# EAGLE design ESP32-S3 4.2“ EINK V1.3 (EAGLE 6.1)
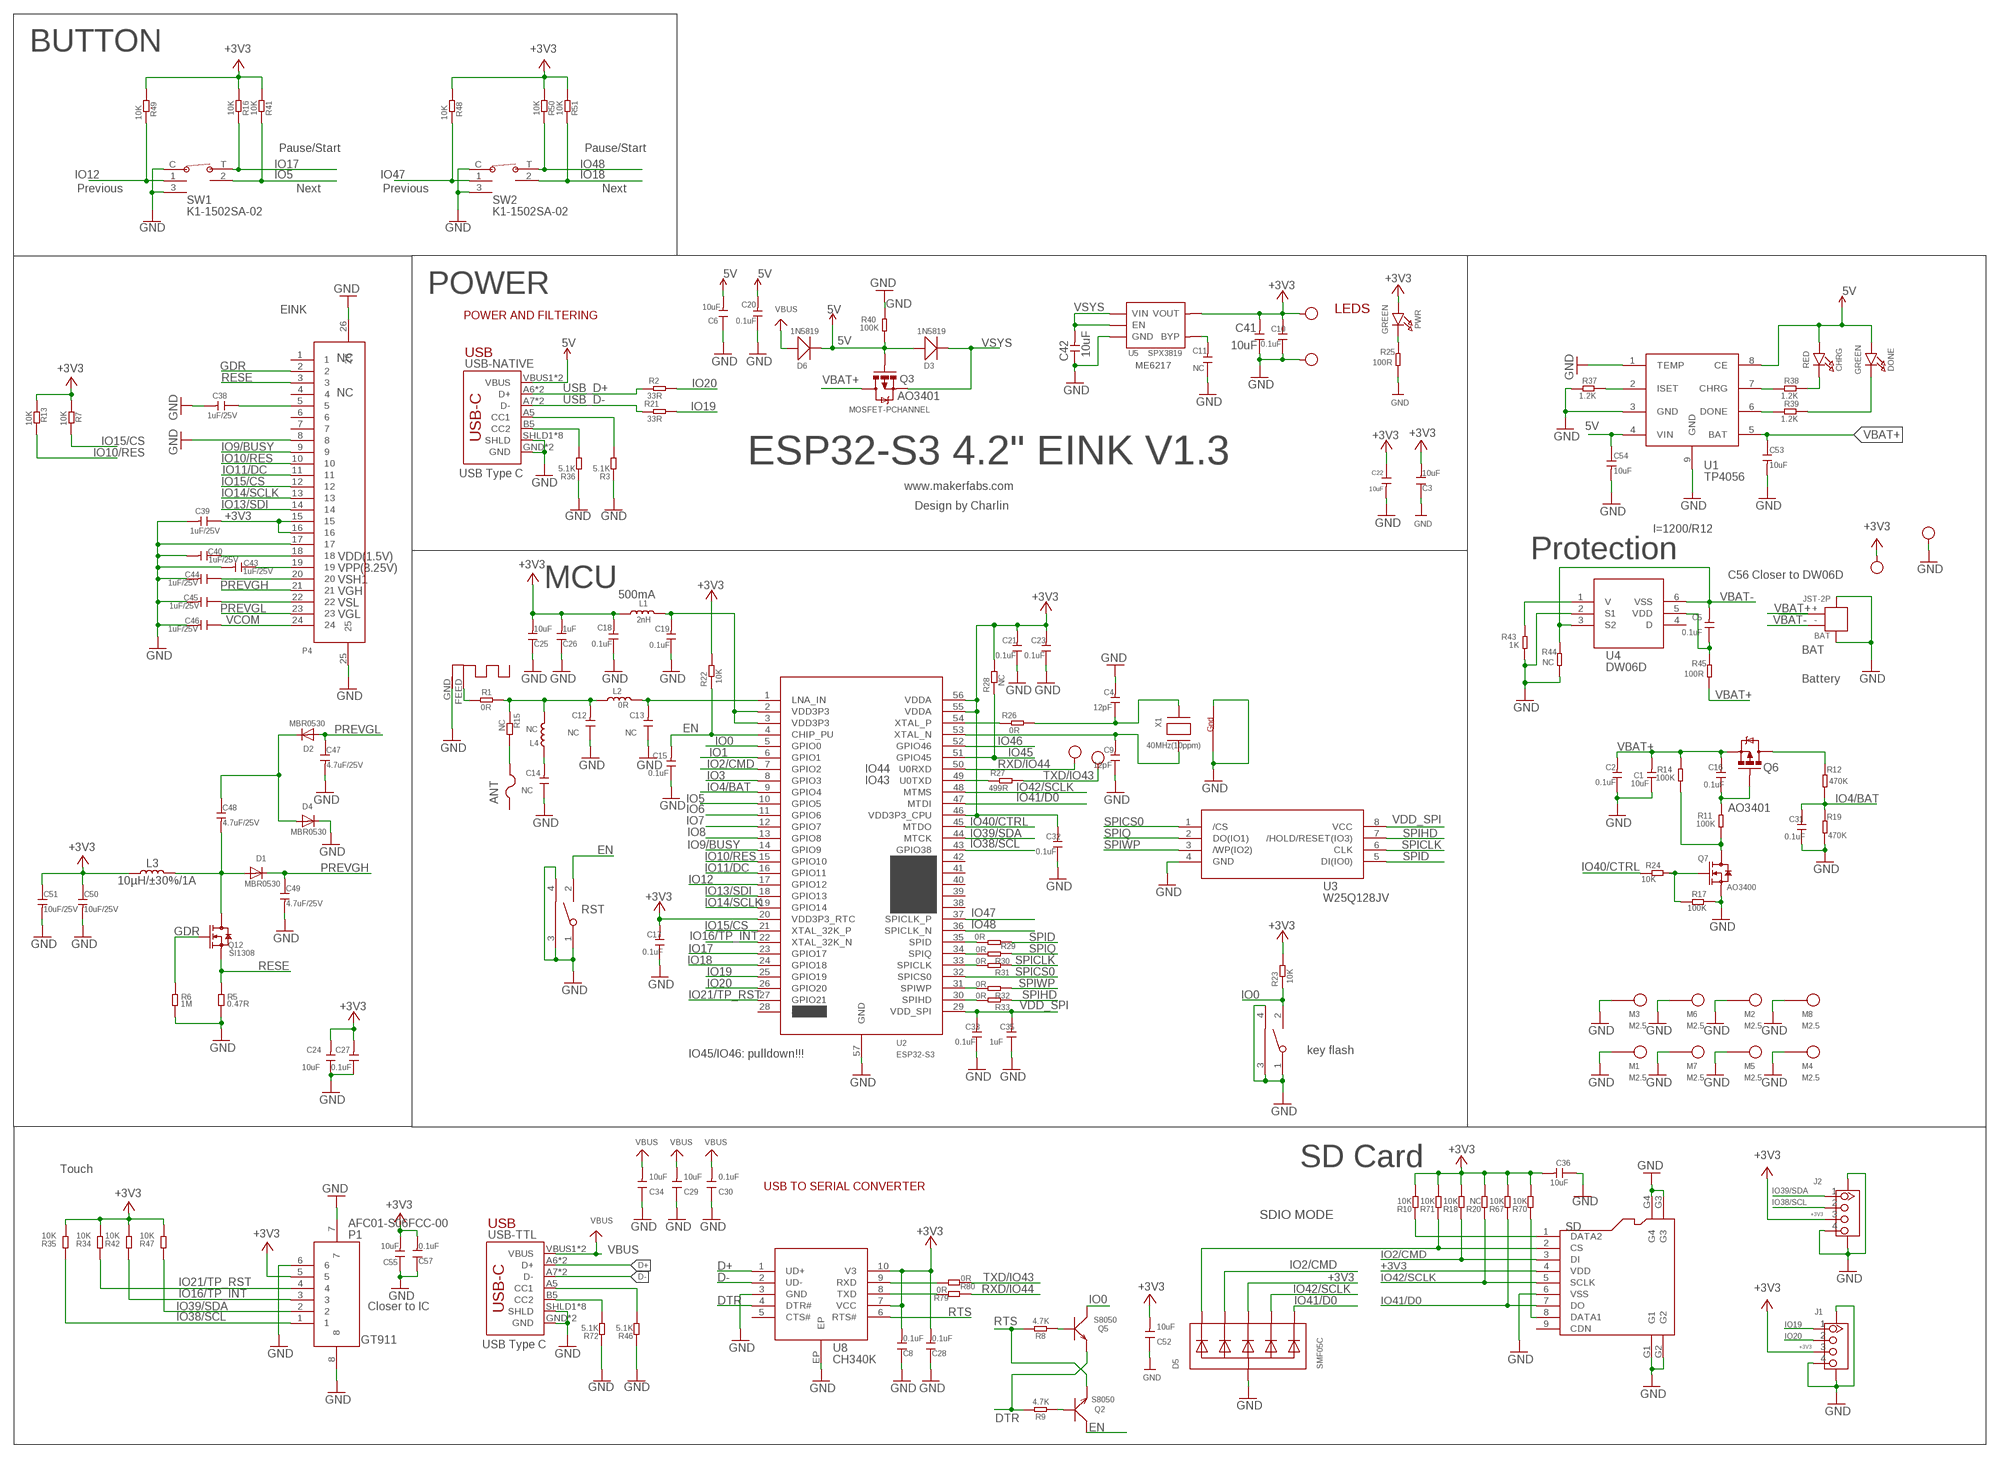
[diagram p0: schematic, sheet 1]

## Parts
3V3  TEST-POINT'4545'  [TP-D45MIL]
ANT  PTCFUSE-1206  [R1206]
ANT1  ANTENNA  [RN-ANT]
BAT  JST-2P  JST-2P-SMD'2.0'  [HW2-SMD-2.0-90D]
C1  10uF  C-0603  [0603]
C2  0.1uF  C-0603  [0603]
C3  10uF  DISCRETE_C-0603  [DISCRETE_C0603]
C4  12pF  C-0603  [0603]
C5  0.1uF  C-0603  [0603]
C6  10uF  DISCRETE_C-0603  [DISCRETE_C0603]
C8  0.1uF  DISCRETE_C-0603  [DISCRETE_C0603]
C9  12pF  C-0603  [0603]
C10  0.1uF  C-0603  [0603]
C11  NC  C-0603  [0603]
C12  NC  C-0603  [0603]
C13  NC  C-0603  [0603]
C14  NC  C-0603  [0603]
C15  0.1uF  C-0603  [0603]
C16  0.1uF  C-0603  [0603]
C17  0.1uF  C-0603  [0603]
C18  0.1uF  C-0603  [0603]
C19  0.1uF  C-0603  [0603]
C20  0.1uF  C-0603  [0603]
C21  0.1uF  C-0603  [0603]
C22  10uF  C-0603  [0603]
C23  0.1uF  C-0603  [0603]
C24  10uF  C-0603  [0603]
C25  10uF  DISCRETE_C-0603  [DISCRETE_C0603]
C26  1uF  DISCRETE_C-0603  [DISCRETE_C0603]
C27  0.1uF  C-0603  [0603]
C28  0.1uF  DISCRETE_C-0603  [DISCRETE_C0603]
C29  10uF  DISCRETE_C-0603  [DISCRETE_C0603]
C30  0.1uF  DISCRETE_C-0603  [DISCRETE_C0603]
C31  0.1uF  C-0603  [0603]
C32  0.1uF  C-0603  [0603]
C33  0.1uF  C-0603  [0603]
C34  10uF  DISCRETE_C-0603  [DISCRETE_C0603]
C35  1uF  C-0603  [0603]
C36  10uF  DISCRETE_C-0603  [DISCRETE_C0603]
C38  1uF/25V  C-0603  [0603]
C39  1uF/25V  C-0603  [0603]
C40  1uF/25V  C-0603  [0603]
C41  10uF  C-0603  [0603]
C42  10uF  C-0603  [0603]
C43  1uF/25V  C-0603  [0603]
C44  1uF/25V  C-0603  [0603]
C45  1uF/25V  C-0603  [0603]
C46  1uF/25V  C-0603  [0603]
C47  4.7uF/25V  C-0603  [0603]
C48  4.7uF/25V  C-0603  [0603]
C49  4.7uF/25V  C-0603  [0603]
C50  10uF/25V  C-0603  [0603]
C51  10uF/25V  C-0603  [0603]
C52  10uF  DISCRETE_C-0603  [DISCRETE_C0603]
C53  10uF  C-0603  [0603]
C54  10uF  C-0603  [0603]
C55  10uF  DISCRETE_C-0603  [DISCRETE_C0603]
C57  0.1uF  DISCRETE_C-0603  [DISCRETE_C0603]
CHRG  RED  LED0805_NOOUTLINE  [CHIPLED_0805_NOOUTLINE]
D1  MBR0530  DIODESOD-323F  [SOD-323F]
D2  MBR0530  DIODESOD-323F  [SOD-323F]
D3  1N5819  D'0805'  [SOD323]
D4  MBR0530  DIODESOD-323F  [SOD-323F]
D5  SMF05C  TVSARRAY_5LANE  [SOT363]
D6  1N5819  D'0805'  [SOD323]
DONE  GREEN  LED0805_NOOUTLINE  [CHIPLED_0805_NOOUTLINE]
FLASH  TS24CA  [2*4*3.5MM]
G  TEST-POINT'4545'  [TP-D45MIL]
GND  TEST-POINT'4545'  [TP-D45MIL]
J1  GROVE-CONNECTOR-SMD'90D'  [HW4-SMD-2.0-90D]
J2  GROVE-CONNECTOR-SMD'90D'  [HW4-SMD-2.0-90D]
L1  2nH  DISCRETE_L0603  [DISCRETE_L0603]
L2  0R  INDUCTOR-0603-33NH  [0603]
L3  10µH/±30%/1A  INDUCTOR-CR54-47UH  [CR54]
L4  NC  INDUCTOR-0603-33NH  [0603]
M1  M2.5  [M2.5]
M2  M2.5  [M2.5]
M3  M2.5  [M2.5]
M4  M2.5  [M2.5]
M5  M2.5  [M2.5]
M6  M2.5  [M2.5]
M7  M2.5  [M2.5]
M8  M2.5  [M2.5]
P1  AFC01-S06FCC-00  [SMD8-50P-740L535W]
P4  FPC-24P  [SMD26-50P-1760L450W]
PWR  GREEN  LED0805_NOOUTLINE  [CHIPLED_0805_NOOUTLINE]
Q2  S8050  TRANSISTOR-NPN-SOT23  [SOT23]
Q3  MOSFET-PCHANNEL  [SOT23-3]
Q5  S8050  TRANSISTOR-NPN-SOT23  [SOT23]
Q6  MOSFET-PCHANNEL  [SOT23-3]
Q7  AO3400  DISCRETE_MOSFET-NSOT23  [DISCRETE_SOT23]
Q12  SI1308  MOSFET-N'SOT23'  [SOT23]
R1  0R  R-0603  [R0603]
R2  33R  R-0603  [R0603]
R3  5.1K  DISCRETE_R-0603  [DISCRETE_R0603]
R5  0.47R  R-0603  [R0603]
R6  1M  R-0603  [R0603]
R7  10K  R-0603  [R0603]
R8  4.7K  R-0603  [R0603]
R9  4.7K  R-0603  [R0603]
R10  10K  DISCRETE_R-0603  [DISCRETE_R0603]
R11  100K  R-0603  [R0603]
R12  470K  R-0603  [R0603]
R13  10K  R-0603  [R0603]
R14  100K  R-0603  [R0603]
R15  NC  R-0603  [R0603]
R16  10K  R-0603  [R0603]
R17  100K  R-0603  [R0603]
R18  10K  DISCRETE_R-0603  [DISCRETE_R0603]
R19  470K  R-0603  [R0603]
R20  NC  DISCRETE_R-0603  [DISCRETE_R0603]
R21  33R  R-0603  [R0603]
R22  10K  R-0603  [R0603]
R23  10K  R-0603  [R0603]
R24  10K  R-0603  [R0603]
R25  100R  R-0603  [R0603]
R26  0R  R-0603  [R0603]
R27  499R  R-0603  [R0603]
R28  NC  R-0603  [R0603]
R29  0R  R-0603  [R0603]
R30  0R  R-0603  [R0603]
R31  0R  R-0603  [R0603]
R32  0R  R-0603  [R0603]
R33  0R  R-0603  [R0603]
R34  10K  DISCRETE_R-0603  [DISCRETE_R0603]
R35  10K  DISCRETE_R-0603  [DISCRETE_R0603]
R36  5.1K  DISCRETE_R-0603  [DISCRETE_R0603]
R37  1.2K  R-0603  [R0603]
R38  1.2K  R-0603  [R0603]
R39  1.2K  R-0603  [R0603]
R40  100K  R-0603  [R0603]
R41  10K  R-0603  [R0603]
R42  10K  DISCRETE_R-0603  [DISCRETE_R0603]
R43  1K  R-0603  [R0603]
R44  NC  R-0603  [R0603]
R45  100R  R-0603  [R0603]
R46  5.1K  DISCRETE_R-0603  [DISCRETE_R0603]
R47  10K  DISCRETE_R-0603  [DISCRETE_R0603]
R48  10K  R-0603  [R0603]
R49  10K  R-0603  [R0603]
R50  10K  R-0603  [R0603]
R51  10K  R-0603  [R0603]
R67  10K  DISCRETE_R-0603  [DISCRETE_R0603]
R70  10K  DISCRETE_R-0603  [DISCRETE_R0603]
R71  10K  DISCRETE_R-0603  [DISCRETE_R0603]
R72  5.1K  DISCRETE_R-0603  [DISCRETE_R0603]
R79  0R  R-0603  [R0603]
R80  0R  R-0603  [R0603]
RST  TS24CA  [2*4*3.5MM]
RX  TEST-POINT'4545'  [TP-D45MIL]
SD  HOLDER-MICROSD-9P  [9P-SMD-W/-RING]
SW1  K1-1502SA-02  [SMD5-60P-1180L1170W]
SW2  K1-1502SA-02  [SMD5-60P-1180L1170W]
TX  TEST-POINT'4545'  [TP-D45MIL]
U1  TP4056  [SOP8-1.27P]
U2  ESP32-S3  [QFN56-7*7MM]
U3  W25Q128JV  [SOIC-8-208MIL]
U4  DW06D  [SOT-23-6]
U5  SPX3819  [SOT23-5]
U8  CH340K  [ESOP-10-EP-150MIL]
USB-NATIVE  USB_C5  [USB-C-16P-5]
USB-TTL  USB_C5  [USB-C-16P-5]
V  TEST-POINT'4545'  [TP-D45MIL]
X1  40MHz(10ppm)  XTAL-4-3225  [NX3225]

## Nets
5V: C6.2 C20.2 C54.1 CHRG.A D3.+ D6.- DONE.A Q3.1(G) R40.1 U1.4(VIN) U1.8(CE) USB-NATIVE.VBUS1(VBUS) USB-NATIVE.VBUS2(VBUS)
+3V3: 3V3.T C3.2 C8.2 C10.2 C17.2 C18.2 C21.2 C22.1 C23.2 C24.2 C25.2 C26.2 C27.2 C28.2 C32.2 C36.2 C39.1 C41.2 C50.1 C51.1 C52.2 C55.2 C57.2 D5.4(C3) J1.3 J2.3 L1.1 L3.P$1 P1.5 P4.15 P4.16 PWR.A R7.1 R10.2 R13.1 R16.1 R18.2 R20.2 R22.2 R23.2 R28.2 R34.2 R35.2 R41.1 R42.2 R47.2 R48.1 R49.1 R50.1 R51.1 R67.2 R70.2 R71.2 SD.4(VDD) U2.20(VDD3P3_RTC) U2.46(VDD3P3_CPU) U2.55(VDDA) U2.56(VDDA) U5.5(VOUT) U8.7(VCC) U8.10(V3) V.T
D+: U8.1(UD+) USB-TTL.A6(D+) USB-TTL.B6(D+)
D-: U8.2(UD-) USB-TTL.A7(D-) USB-TTL.B7(D-)
DONE: R39.2 U1.6(DONE)
DTR: Q5.2(E) R9.2 U8.4(DTR#)
EN: C15.2 Q2.3(C) R22.1 RST.2 U2.4(CHIP_PU)
GDR: P4.2 Q12.1(G) R6.1
GND: ANT1.GND BAT.3 BAT.4 C1.1 C2.1 C3.1 C4.2 C6.1 C8.1 C9.1 C10.1 C11.1 C12.1 C13.1 C14.1 C15.1 C17.1 C18.1 C19.1 C20.1 C21.1 C22.2 C23.1 C24.1 C25.1 C26.1 C27.1 C28.1 C29.1 C30.1 C31.1 C32.1 C33.1 C34.1 C35.1 C36.1 C38.2 C39.2 C40.2 C41.1 C42.1 C43.2 C44.2 C45.2 C46.2 C47.2 C49.2 C50.2 C51.2 C52.1 C53.2 C54.2 C55.1 C57.1 D4.C D5.2(A) FLASH.1 FLASH.3 FLASH.4 G.T GND.T J1.4 J1.SS1 J1.SS2 J2.4 J2.SS1 J2.SS2 M1.1 M2.1 M3.1 M4.1 M5.1 M6.1 M7.1 M8.1 P1.6 P1.7 P1.8 P4.8 P4.17 P4.25 P4.26 Q7.2(S) R3.1 R5.2 R6.2 R17.1 R19.1 R25.1 R36.1 R37.2 R40.2 R43.1 R44.1 R46.1 R72.1 RST.1 RST.3 RST.4 SD.6(VSS) SD.G1 SD.G2 SD.G3 SD.G4 SW1.3 SW1.C SW2.3 SW2.C U1.1(TEMP) U1.3(GND) U1.9(GND) U2.57(GND) U3.4(GND) U4.2(S1) U5.2(GND) U8.3(GND) U8.EP USB-NATIVE.GND USB-NATIVE.GND2(GND) USB-NATIVE.SHLD1(SHLD) USB-NATIVE.SHLD2(SHLD) USB-NATIVE.SHLD3(SHLD) USB-NATIVE.SHLD4(SHLD) USB-NATIVE.SHLD5(SHLD) USB-NATIVE.SHLD6(SHLD) USB-NATIVE.SHLD7(SHLD) USB-NATIVE.SHLD8(SHLD) USB-TTL.GND USB-TTL.GND2(GND) USB-TTL.SHLD1(SHLD) USB-TTL.SHLD2(SHLD) USB-TTL.SHLD3(SHLD) USB-TTL.SHLD4(SHLD) USB-TTL.SHLD5(SHLD) USB-TTL.SHLD6(SHLD) USB-TTL.SHLD7(SHLD) USB-TTL.SHLD8(SHLD) X1.2(G2) X1.4(G1)
IO0: FLASH.2 Q5.3(C) R23.1 U2.5(GPIO0)
IO1: U2.6(GPIO1)
IO2/CMD: D5.3(C2) R18.1 SD.3(DI) U2.7(GPIO2)
IO3: U2.8(GPIO3)
IO4/BAT: C31.2 R12.1 R19.2 U2.9(GPIO4)
IO5: R41.2 SW1.2 U2.10(GPIO5)
IO6: U2.11(GPIO6)
IO7: U2.12(GPIO7)
IO8: U2.13(GPIO8)
IO9/BUSY: P4.9 U2.14(GPIO9)
IO10/RES: P4.10 R13.2 U2.15(GPIO10)
IO11/DC: P4.11 U2.16(GPIO11)
IO12: R49.2 SW1.1 U2.17(GPIO12)
IO13/SDI: P4.14 U2.18(GPIO13)
IO14/SCLK: P4.13 U2.19(GPIO14)
IO15/CS: P4.12 R7.2 U2.21(XTAL_32K_P)
IO16/TP_INT: P1.3 R42.1 U2.22(XTAL_32K_N)
IO17: R16.2 SW1.T U2.23(GPIO17)
IO18: R51.2 SW2.2 U2.24(GPIO18)
IO19: J1.1 R21.2 U2.25(GPIO19)
IO20: J1.2 R2.2 U2.26(GPIO20)
IO21/TP_RST: P1.4 R34.1 U2.27(GPIO21)
IO38/SCL: J2.2 P1.1 R35.1 U2.43(GPIO38)
IO39/SDA: J2.1 P1.2 R47.1 U2.44(MTCK)
IO40/CTRL: R24.2 U2.45(MTDO)
IO41/D0: D5.6(C5) R67.1 SD.7(DO) U2.47(MTDI)
IO42/SCLK: D5.5(C4) R20.1 SD.5(SCLK) U2.48(MTMS)
IO45: R28.1 U2.51(GPIO45)
IO46: U2.52(GPIO46)
IO47: R48.2 SW2.1 U2.37(SPICLK_P)
IO48: R50.2 SW2.T U2.36(SPICLK_N)
ISET: R37.1 U1.2(ISET)
N$1: C38.1 P4.5
N$2: ANT1.FEED R1.1
N$3: C16.1 Q6.1(G) R11.2
N$4: C43.1 P4.19
N$5: C44.1 P4.20
N$6: R3.2 USB-NATIVE.A5(CC1)
N$7: PWR.C R25.2
N$8: Q2.1(B) R9.1
N$9: C45.1 P4.22
N$10: Q6.3(D) R12.2
N$11: C48.1 D2.C D4.A
N$12: Q5.1(B) R8.1
N$13: R79.2 U8.8(TXD)
N$14: R36.2 USB-NATIVE.B5(CC2)
N$15: Q7.3(D) R11.1 R14.1
N$16: R10.1 SD.1(DATA2)
N$17: R46.2 USB-TTL.A5(CC1)
N$18: R72.2 USB-TTL.B5(CC2)
N$19: Q7.1(G) R17.2 R24.1
N$20: R70.1 SD.8(DATA1)
N$22: C40.1 P4.18
N$23: DONE.C R39.1
N$24: R38.2 U1.7(CHRG)
N$25: ANT.2 R15.2
N$26: D5.1(C1) R71.1 SD.2(CS)
N$27: CHRG.C R38.1
N$28: C5.1 R45.2 U4.5(VDD)
N$29: R43.2 U4.1(V)
N$30: C12.2 L2.1 L4.2 R1.2 R15.1
N$31: C13.2 L2.2 U2.1(LNA_IN)
N$32: R29.2 U2.35(SPID)
N$33: C19.2 L1.2 U2.2(VDD3P3) U2.3(VDD3P3)
N$34: C14.2 L4.1
N$35: R30.2 U2.34(SPIQ)
N$36: R80.2 U8.9(RXD)
N$37: R26.1 U2.54(XTAL_P)
N$38: R31.2 U2.33(SPICLK)
N$40: R32.2 U2.31(SPIWP)
N$41: R33.2 U2.30(SPIHD)
N$63: R27.1 U2.49(U0TXD)
N$65: C9.2 U2.53(XTAL_N) X1.3(X2)
N$66: C4.1 R26.2 X1.1(X1)
N$71: C48.2 D1.A L3.P$2 Q12.3(D)
N$76: C11.2 U5.4(BYP)
PREVGH: C49.1 D1.C P4.21
PREVGL: C47.1 D2.A P4.23
RESE: P4.3 Q12.2(S) R5.1
RTS: Q2.2(E) R8.2 U8.6(RTS#)
RXD/IO44: R79.1 RX.T U2.50(U0RXD)
SPICLK: R31.1 U3.6(CLK)
SPICS0: U2.32(SPICS0) U3.1(/CS)
SPID: R29.1 U3.5(DI(IO0))
SPIHD: R33.1 U3.7(/HOLD/RESET(IO3))
SPIQ: R30.1 U3.2(DO(IO1))
SPIWP: R32.1 U3.3(/WP(IO2))
TXD/IO43: R27.2 R80.1 TX.T
USB_D+: R2.1 USB-NATIVE.A6(D+) USB-NATIVE.B6(D+)
USB_D-: R21.1 USB-NATIVE.A7(D-) USB-NATIVE.B7(D-)
VBAT+: BAT.+ C1.2 C2.2 C16.2 C53.1 Q3.3(D) Q6.2(S) R14.2 R45.1 U1.5(BAT)
VBAT-: BAT.- C5.2 R44.2 U4.3(S2) U4.6(VSS)
VBUS: C29.2 C30.2 C34.2 D6.+ USB-TTL.VBUS1(VBUS) USB-TTL.VBUS2(VBUS)
VCOM: C46.1 P4.24
VDD_SPI: C33.2 C35.2 U2.29(VDD_SPI) U3.8(VCC)
VSYS: C42.2 D3.- Q3.2(S) U5.1(VIN) U5.3(EN)
Unconnected: ANT.1 P4.1 P4.4 P4.6 P4.7 SD.9(CDN) U2.28(SPICS1) U2.38(GPIO33) U2.39(GPIO34) U2.40(GPIO35) U2.41(GPIO36) U2.42(GPIO37) U4.4(D) U8.5(CTS#)

## Notes on the sheet
- BUTTON
- Pause/Start | Pause/Start
- Previous | Next | Previous | Next
- POWER
- EINK | LEDS
- POWER AND FILTERING
- USB
- NC
- ME6217
- NC
- AO3401
- ESP32-S3 4.2" EINK V1.3
- USB Type C
- www.makerfabs.com
- Design by Charlin
- I=1200/R12
- VDD(1.5V) | Protection
- VPP(8.25V)
- C56 Closer to DW06D
- VSH1
- MCU
- VGH
- 500mA
- VSL
- VGL
- BAT
- Battery
- IO44
- IO43
- AO3401
- RST
- key flash
- IO45/IO46: pulldown!!!
- SD Card
- Touch
- USB TO SERIAL CONVERTER
- SDIO MODE
- USB
- Closer to IC
- GT911
- USB Type C

## Library data of the parts
3V3 G GND RX TX V = Discrete-new:TEST-POINT; PARTNO: DNP
ANT = adafruit:PTCFUSE: PTC fuses, resettable thermistors
ANT1 = adafruit:ANTENNA
BAT = Connector-new:JST-2P-SMD: 2P-SMD-1.0-90D:320110054;2P-SMD-2.0-90D:320110026
C1 C2 C4 C5 C9-C24 C27 C31-C33 C35 C38-C51 C53 C54 = Discrete:C*: Ceramic Capacitors
C3 C6 C8 C25 C26 C28-C30 C34 C36 C52 C55 C57 = A9G:DISCRETE_C*: Ceramic Capacitors
CHRG DONE PWR = microbuilder:LED: LED 0603 - 0603 Surface Mount Package 2mA: Green LED - Low Power (3.9mcd, 2ma, 1.7Vf) - Digikey: 475-2709-2-ND Orange LED - Low Power (9.8mcd, 2ma, 1.8Vf) - Digikey: 475-1194-2-ND Red LED - Low Power (5mcd, 2ma, 1.8Vf) - Digikey: 475-1195-2-ND Yellow LED - Low Power (7mcd, 2ma, 1.8Vf) - Digikey: 475-1196-2-ND 5mA: Blue LED - Low Power (17mcd, 5ma, 2.9Vf) - Digikey: LNJ937W8CRACT-ND 0805 - 0805 Surface Mount Package 2mA: Red LED (8.8mcd, 2mA, 1.8Vf, Clear) - Low Power [Digikey: 475-2510-1-ND] Green LED (5mcd, 2mA, 1.8Vf, Clear) - Low Power [Digikey: 475-2730-1-ND] Yellow LED (11.3mcd, 2mA, 1.8Vf, Clear) - Low Power [Digikey: 475-2555-1-ND] 20mA: Red LED (104mcd, 20mA, Diffused) - LS R976 [Digikey: 475-1278-6-ND] Red LED (12mcd, 20mA, 2.0Vf, Clear) - APT2012EC [Digikey: 754-1128-1-ND] Green LED (15mcd, 20mA, 2.2Vf, Clear) - APT2012GC [Digikey: 754-1131-1-ND] Orange LED (160mcd, 20mA, 2.1Vf, Clear) - APT2012SECK [Digikey: 754-1130-1-ND] 1206 - 1206 Surface Mount Package Green LED (26mcd, 20mA, Diffused) - LG N971 [Digikey: 475-1407-6-ND] Red LED (15mcd, 20mA, Diffused) - LH N974 [Digikey: 475-1416-6-ND] Cree - Cree High-Power Surface Mount LEDs XPEBWT-L1-0000-00D50 - White 111lm 350mA 2.9Vf 6200K 110° XTEAWT-00-0000-00000LEE3 - White 114lm 350mA 2.85Vf 5000K 115° Everlight - Everlight 45-21 Series Surface Mount LEDs 45-21/QK2C-B2832AC2CB2/2T - Warm White 2000mcd 20mA 3.25Vf 3050K 120° 45-21/LK2C-B38452C4CB2/2T - Nuetral White 2000mcd 20mA 3.25Vf 4150K 120° 45-21/LK2C-B50634C6CB2/2T - Cold White 2200mcd 20mA 3.25Vf 5650K 120° PLCC2 Reverse Mount LS T77K-J1L2-1-0-2-R18-Z - Red 11.25mcd 2mA 1.8Vf 630nm 120° LO T77K-L1M2-24-Z - Orange 19.6mcd 2mA 1.8Vf 606nm 120° LY T77K-K2M1-26-Z - Yellow 15.7mcd 2mA 1.8Vf 587nm 120°
D1 D2 D4 = adafruit2:DIODE: Diode SMADIODE - SMA Surface Mount Package 20V 1A Schottky Diode Digikey: 641-1014-6-ND DO-1N4148 - Through Hole Small Current Diode SOD-123 20V 1 A (.5mV Vf) Schottky Diode - Digikey: MBRX120TPMSCT-ND SOD-323 10V 570mA (.38mV Vf, 3ns) Schottky Diode - Digikey: ZLLS410CT-ND SOD-523 30V 30mA Schottky Diode (RB751S-40TE61) - Digikey: RB751S-40TE61CT-ND SOT23-R/W - SOT23 Package (R = Solder Paste/Reflow Ovens, W = Hand-Soldering) BAT54Film 40V 300mA - Digikey: 497-7162-1-ND
D3 D6 = Discrete:D*
D5 = microbuilder:TVSARRAY_5LANE: Voltage Transient Suppressor Array SOT363 SMF05C - 100W 5V: Digikey - SMF05CT1GOSCT-ND
FLASH RST = sale:TS24CA
J1 J2 = Connector-new:GROVE-CONNECTOR-SMD: 4P-SMD-2.0:320110030;4P-SMD-2.0-90D:320110032
L1 = A9G:DISCRETE_L*
L2 L4 = SparkFun-Coils:INDUCTOR: Inductors Resist changes in electrical current. Basically a coil of wire. SparkFun Products: SparkFun Load Cell Amplifier - HX711 <https://www.sparkfun.com/products/13879> IOIO-OTG - V2.2 <https://www.sparkfun.com/products/13613>; PROD_ID: NDUC-07874; VALUE: 33nH/±5%/500mA
L3 = SparkFun-Coils:INDUCTOR: Inductors Resist changes in electrical current. Basically a coil of wire. SparkFun Products: SparkFun Load Cell Amplifier - HX711 <https://www.sparkfun.com/products/13879> IOIO-OTG - V2.2 <https://www.sparkfun.com/products/13613>; PROD_ID: NDUC-10789; VALUE: 47µH/±30%/750mA
M1-M8 = sale:M2.5
P1 = self:AFC01-S06FCC-00
P4 = self:FPC-24P
Q2 Q5 = Discrete:TRANSISTOR-NPN*: NPN audion
Q3 Q6 = User-Submitted:MOSFET-PCHANNEL: Generic PMOSFET IRLML2244 - TRANS-11153 (SOT-23 -20V -4.3A) (1.Gate 2.Source 3.Drain) FQP27P06 - COM-10349 <http://www.sparkfun.com/products/10349> (TO-220 -60V -27A) (1.Gate 2.Source 3.Drain); PROD_ID: TRANS-08285
Q7 = A9G:DISCRETE_MOSFET-N: IRLL014: http://www.vishay.com/docs/91319/sihll014.pdf
Q12 = Discrete:MOSFET-N: IRLL014: http://www.vishay.com/docs/91319/sihll014.pdf
R1 R2 R5-R9 R11-R17 R19 R21-R33 R37-R41 R43-R45 R48-R51 R79 R80 = Discrete:R*
R3 R10 R18 R20 R34-R36 R42 R46 R47 R67 R70-R72 = A9G:DISCRETE_R*
SD = Connector:HOLDER-MICROSD-9P
SW1 SW2 = self:K1-1502SA-02
U1 = self:TP4056
U2 = sale:ESP32-S3
U3 = self:W25Q128JV
U4 = self:DW06D
U5 = IC:SPX3819
U8 = sale:CH340K
USB-NATIVE USB-TTL = USBC:USB_C: USB Type C 16Pin Connector Super Speed pins not available on the 16-pin purely SMD connector so this part is best for USB 2.0 implementations. D1 and D2 are tied together enabling D+/- no matter which way the cable is plugged into the connector. The two channel configuration pins (CC1/2) are exposed. These are normally connected to ground via 5.1k resistors but can be reconfigured for high current/high power applications.
X1 = adafruit:XTAL-4: Classic 4-pin 3.2 x 2.5mm crystal

## Net classes
0 default: width 0.203 mm, drill 0.305 mm, clearance 0.152 mm
1 vbat: width 0.254 mm, drill 0.305 mm, clearance 0.152 mm

## Board
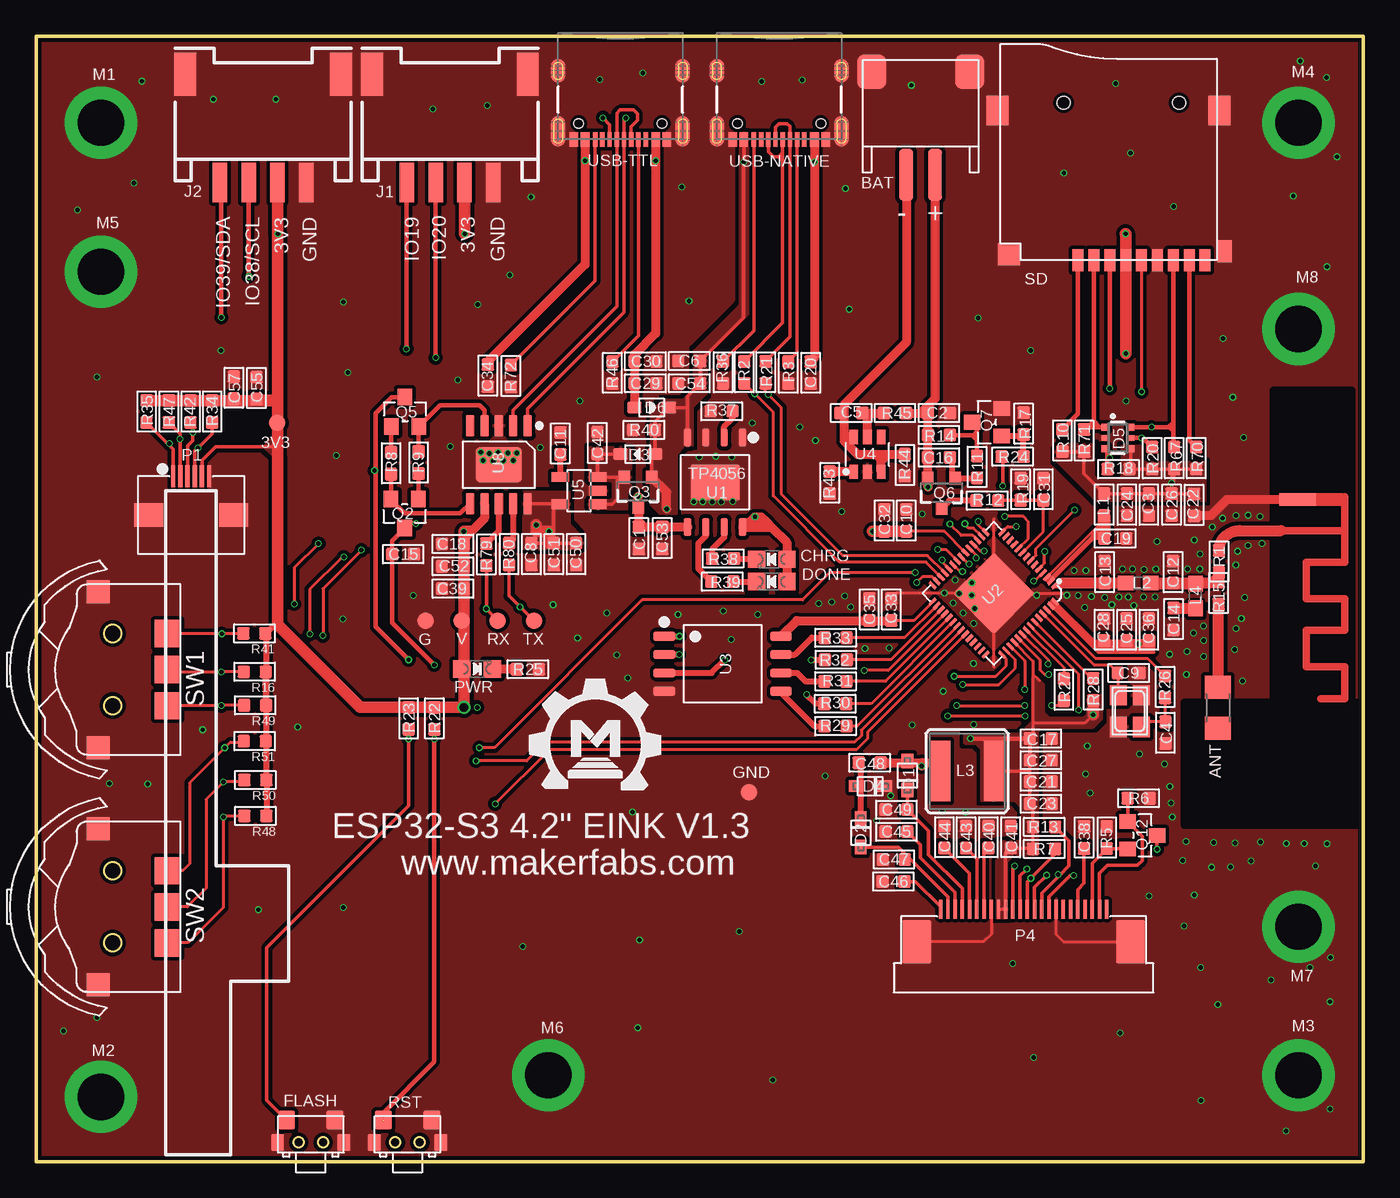
[diagram p1: board, top side]
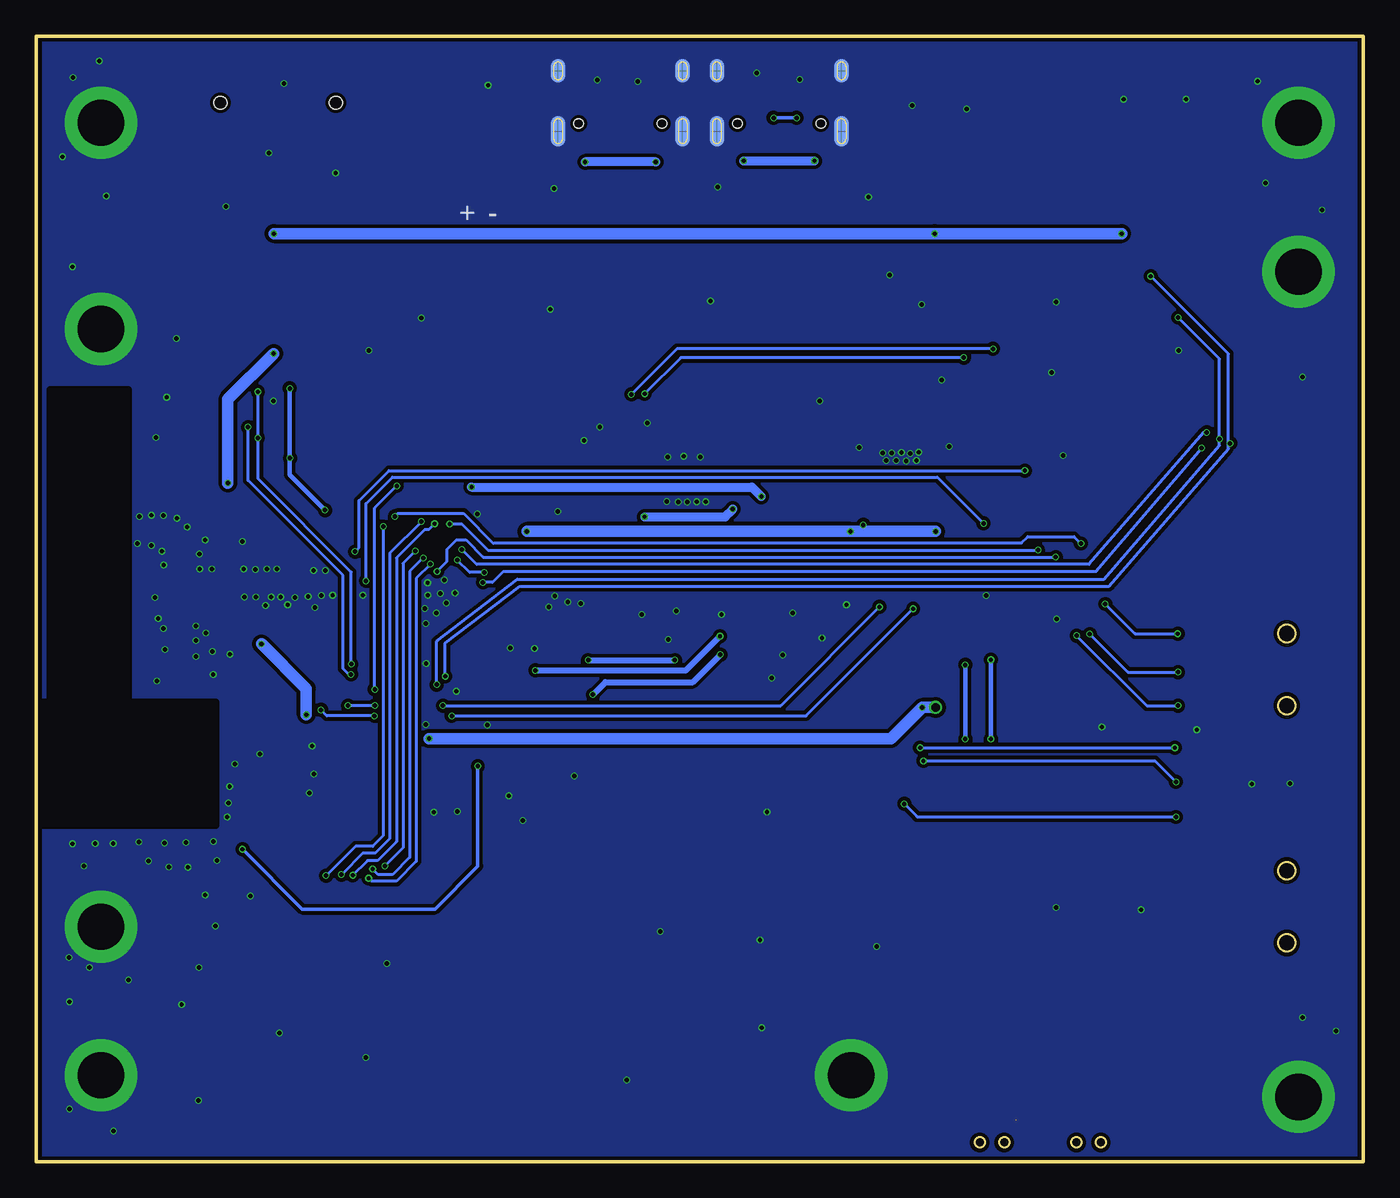
[diagram p2: board, bottom side, seen from below]

Size 92 x 78 mm. Coordinates in mm from the lower left corner, seen from the top.
Outline: 0,78 92,78 92,0 0,0 0,78
Copper layers (1*16): Top 0.035mm / dielectric 1.5mm / Bottom 0.035mm
Design rules: minimum track width 6mil, minimum drill 10mil, track to track 6mil, track to pad 6mil, pad to pad 6mil, via to via 6mil, smd to smd 0mil, copper to edge 10mil, drill to drill 10mil, minimum pad ring 3mil, minimum via ring 3mil, stop-mask expansion 2mil, vias tented up to drill 100mil, thermal gap 0mil
tRestrict: area 85.8,29 to 91.2,53.5; area 79.6,23.3 to 91.5,31.8
bRestrict: area 85.6,29 to 91,53.5; area 79.5,23.3 to 91.5,31.8

### Footprints (pad centres in the part's own frame; a part is rotated, then mirrored left to right if it is on the bottom)
TP-D45MIL = smd 1.143 x 1.143: T 0,0
R1206 = smd 1.6 x 1.803: 1 -1.422,0; 2 1.422,0
RN-ANT = smd 0.025 x 0.025: FEED 0,2.159 | smd 2.54 x 0.889: GND -1.143,0
HW2-SMD-2.0-90D = smd 2 x 2.4: 3 3.4,-2.181; 4 -3.4,-2.181 | smd 1 x 3.6: + -1,4.953; - 1,4.953
0603 = smd 0.889 x 0.889: 1 -0.762,0; 2 0.762,0
DISCRETE_C0603 = smd 0.889 x 0.889: 1 -0.762,0; 2 0.762,0
CHIPLED_0805_NOOUTLINE = smd 1.2 x 1.2: A 0,-1.05; C 0,1.05
SOD-323F = smd 1 x 0.8: A -1,0; C 1,0
SOD323 = smd 1 x 0.8: + -1.2,0; - 1.2,0
SOT363 = smd 0.5 x 0.5: 1 -0.75,-0.9; 3 0.75,-0.9; 4 0.75,0.9; 6 -0.75,0.9 | smd 0.4 x 0.5: 2 0,-0.9; 5 0,0.9
2*4*3.5MM = smd 1.15 x 1.3: 1 -1.675,0; 2 1.675,0 | smd 0.9 x 1.2: 3 2.3,1.55; 4 -2.3,1.55
HW4-SMD-2.0-90D = smd 1.01 x 2.74: 1 -3,-0.1; 2 -1,-0.1; 3 1,-0.1; 4 3,-0.1 | smd 1.5 x 3: SS1 -5.4,7.4; SS2 5.4,7.4
DISCRETE_L0603 = smd 0.889 x 0.889: 1 -0.762,0; 2 0.762,0
0603' = smd 1.1 x 1: 1 -0.85,0; 2 0.85,0
CR54 = smd 4.2 x 1.4: P$1 0,1.85; P$2 0,-1.85
M2.5 = drill 3.2 pad 5: 1 0,0
SMD8-50P-740L535W = smd 0.3 x 1.5: 1 -1.25,0; 2 -0.75,0; 3 -0.25,0; 4 0.25,0; 5 0.75,0; 6 1.25,0 | smd 2 x 1.6: 7 2.95,-2.68; 8 -2.95,-2.68
SMD26-50P-1760L450W = smd 0.3 x 1.3: 1 5.75,0; 2 5.25,0; 3 4.75,0; 4 4.25,0; 5 3.75,0; 6 3.25,0; 7 2.75,0; 8 2.25,0; 9 1.75,0; 10 1.25,0; 11 0.75,0; 12 0.25,0; 13 -0.25,0; 14 -0.75,0; 15 -1.25,0; 16 -1.75,0; 17 -2.25,0; 18 -2.75,0; 19 -3.25,0; 20 -3.75,0; 21 -4.25,0; 22 -4.75,0; 23 -5.25,0; 24 -5.75,0 | smd 2 x 3: 25 -7.4,-2.25; 26 7.4,-2.25
SOT23 = smd 1.016 x 1.143: 1 -0.95,-1.016; 2 0.95,-1.016; 3 0,1.016
SOT23-3 = smd 0.8 x 0.9: 1 -0.95,-1; 2 0.95,-1; 3 0,1.1
DISCRETE_SOT23 = smd 1.016 x 1.143: 1 -0.95,-1.016; 2 0.95,-1.016; 3 0,1.016
R0603 = smd 0.889 x 0.889: 1 -0.762,0; 2 0.762,0
DISCRETE_R0603 = smd 0.889 x 0.889: 1 -0.762,0; 2 0.762,0
9P-SMD-W/-RING = smd 1.524 x 0.762: 1 0,4.4; 2 0,3.3; 3 0,2.2; 4 0,1.1; 5 0,0; 6 0,-1.1; 7 0,-2.2; 8 0,-3.3; 9 0,-4.4 | smd 1.524 x 1.016: G1 0.6,-5.746 | smd 2.032 x 1.524: G2 10.373,-5.4; G3 10.373,10 | smd 1.524 x 1.524: G4 0.392,9.181 | hole 0.889: 10.9,-2.6; 10.9,5.4
SMD5-60P-1180L1170W = smd 1.9 x 1.8: 1 -2.5,0; 2 2.5,0; T 0,0 | smd 1.6 x 1.6: 3 -5.4,4.8; C 5.4,4.8
SOP8-1.27P = smd 1.27 x 0.51: 1 -3.1,1.905; 2 -3.1,0.635; 3 -3.1,-0.635; 4 -3.1,-1.905; 5 3.1,-1.905; 6 3.1,-0.635; 7 3.1,0.635; 8 3.1,1.905 | smd 2.5 x 3.4: 9 0,0
QFN56-7*7MM = smd 0.6 x 0.2: 1 -3.4,2.6; 2 -3.4,2.2; 3 -3.4,1.8; 4 -3.4,1.4; 5 -3.4,1; 6 -3.4,0.6; 7 -3.4,0.2; 8 -3.4,-0.2; 9 -3.4,-0.6; 10 -3.4,-1; 11 -3.4,-1.4; 12 -3.4,-1.8; 13 -3.4,-2.2; 14 -3.4,-2.6; 29 3.4,-2.6; 30 3.4,-2.2; 31 3.4,-1.8; 32 3.4,-1.4; 33 3.4,-1; 34 3.4,-0.6; 35 3.4,-0.2; 36 3.4,0.2; 37 3.4,0.6; 38 3.4,1; 39 3.4,1.4; 40 3.4,1.8; 41 3.4,2.2; 42 3.4,2.6 | smd 0.2 x 0.6: 15 -2.6,-3.4; 16 -2.2,-3.4; 17 -1.8,-3.4; 18 -1.4,-3.4; 19 -1,-3.4; 20 -0.6,-3.4; 21 -0.2,-3.4; 22 0.2,-3.4; 23 0.6,-3.4; 24 1,-3.4; 25 1.4,-3.4; 26 1.8,-3.4; 27 2.2,-3.4; 28 2.6,-3.4; 43 2.6,3.4; 44 2.2,3.4; 45 1.8,3.4; 46 1.4,3.4; 47 1,3.4; 48 0.6,3.4; 49 0.2,3.4; 50 -0.2,3.4; 51 -0.6,3.4; 52 -1,3.4; 53 -1.4,3.4; 54 -1.8,3.4; 55 -2.2,3.4; 56 -2.6,3.4 | smd 4 x 4: 57 0,0
SOIC-8-208MIL = smd 1.5 x 0.635: 1 -4.05,1.905; 2 -4.05,0.635; 3 -4.05,-0.635; 4 -4.05,-1.905; 5 4.05,-1.905; 6 4.05,-0.635; 7 4.05,0.635; 8 4.05,1.905
SOT-23-6 = smd 1 x 0.6: 1 -1.2,0.95; 2 -1.2,0; 3 -1.2,-0.95; 4 1.2,-0.95; 5 1.2,0; 6 1.2,0.95
SOT23-5 = smd 0.69 x 1.2: 1 -0.95,-1.3; 2 0,-1.3; 3 0.95,-1.3; 4 0.95,1.3; 5 -0.95,1.3
ESOP-10-EP-150MIL = smd 1.5 x 0.6: 1 -2.7,2; 2 -2.7,1; 3 -2.7,0; 4 -2.7,-1; 5 -2.7,-2; 6 2.7,-2; 7 2.7,-1; 8 2.7,0; 9 2.7,1; 10 2.7,2 | smd 2.4 x 3.2: EP 0,0
USB-C-16P-5 = smd 0.3 x 1: A5 -1.25,-0.34; A6 -0.25,-0.34; A7 0.25,-0.34; A8 1.25,-0.34; B5 1.75,-0.34; B6 0.75,-0.34; B7 -0.75,-0.34; B8 -1.75,-0.34 | smd 0.6 x 1: GND -3.225,-0.34; GND2 3.225,-0.34; VBUS1 -2.45,-0.34; VBUS2 2.45,-0.34 | smd 1 x 2.1: SHLD1 -4.32,-0.915; SHLD2 4.32,-0.915 | smd 1 x 2.1 bottom: SHLD3 -4.32,-0.915; SHLD4 4.32,-0.915 | smd 1 x 1.6: SHLD5 -4.32,-5.095; SHLD8 4.32,-5.095 | smd 1 x 1.6 bottom: SHLD6 -4.32,-5.095; SHLD7 4.32,-5.095 | hole 0.65: -2.89,-1.445; 2.89,-1.445
NX3225 = smd 1.4 x 1.2: 1 -1.1,-0.8; 2 1.1,-0.8; 3 1.1,0.8; 4 -1.1,0.8

### Placement (x,y rotation side)
3V3  16.71,51.2 0 top
ANT  81.91,31.46 90 top
ANT1  86.3,45.89 180 top
BAT  61.31,73.35 180 top
C1  41.77,43.22 90 top
C2  62.58,51.88 180 top
C3  77.13,45.53 90 top
C4  78.27,29.74 270 top
C5  56.51,51.88 180 top
C6  45.28,55.49 0 top
C8  34.33,42.11 90 top
C9  75.73,33.88 180 top
C10  60.32,44.44 270 top
C11  36.34,49.78 270 top
C12  78.81,40.86 270 top
C13  74.06,40.86 270 top
C14  78.83,37.61 90 top
C15  25.44,42.11 180 top
C16  62.58,48.81 180 top
C17  69.64,29.33 180 top
C18  28.9,42.82 0 top
C19  74.8,43.2 180 top
C20  53.69,54.68 90 top
C21  69.64,26.33 180 top
C22  80.26,45.52 270 top
C23  69.64,24.81 180 top
C24  75.61,45.53 90 top
C25  75.58,36.87 270 top
C26  78.71,45.53 90 top
C27  69.64,27.83 180 top
C28  74.03,36.87 270 top
C29  42.23,53.94 180 top
C30  42.23,55.47 180 top
C31  69.82,46.6 270 top
C32  58.79,44.44 270 top
C33  59.28,38.27 270 top
C34  31.31,54.48 90 top
C35  57.75,38.27 270 top
C36  77.13,36.87 270 top
C38  72.64,22.47 90 top
C39  28.9,39.72 180 top
C40  66.01,22.5 90 top
C41  67.56,22.5 270 top
C42  38.9,49.8 270 top
C43  64.46,22.5 90 top
C44  62.96,22.5 90 top
C45  59.63,22.88 180 top
C46  59.43,19.42 180 top
C47  59.45,20.95 180 top
C48  57.78,27.65 0 top
C49  59.63,24.4 180 top
C50  37.43,42.11 270 top
C51  35.88,42.11 270 top
C52  28.9,41.27 0 top
C53  43.4,43.22 270 top
C54  45.28,53.94 180 top
C55  15.28,53.61 270 top
C57  13.71,53.64 270 top
CHRG  51,41.75 90 top
D1  60.39,26.76 270 top
D2  57.17,22.8 90 top
D3  41.7,49.04 180 top
D4  57.83,26.03 0 top
D5  74.97,50.16 270 top
D6  42.66,52.27 0 top
DONE  51,40.2 90 top
FLASH  19.04,2.9 180 top
G  27,37.5 270 top
GND  49.42,25.62 0 top
J1  28.69,67.96 0 top
J2  15.74,67.96 0 top
L1  74.03,45.53 270 top
L2  0R  [0603']  76.4,40.1 180 top
L3  64.53,27.07 270 top
L4  NC  [0603']  80.36,39.21 90 top
M1  4.5,72 0 top
M2  4.5,4.5 0 top
M3  87.5,6 0 top
M4  87.5,72 0 top
M5  4.5,61.66 0 top
M6  35.5,6 0 top
M7  87.5,16.3 0 top
M8  87.5,57.7 0 top
P1  10.75,47.5 0 top
P4  68.45,17.5 0 top
PWR  30.56,34.15 270 top
Q2  25.54,44.92 180 top
Q3  41.72,46.45 180 top
Q5  25.57,51.96 0 top
Q6  62.76,46.37 180 top
Q7  65.91,51.25 90 top
Q12  76.67,22.62 270 top
R1  81.98,41.6 270 top
R2  49.09,54.7 270 top
R3  52.14,54.68 90 top
R5  74.21,22.47 90 top
R6  76.42,25.19 0 top
R7  69.87,21.68 0 top
R8  24.6,48.4 270 top
R9  26.51,48.46 90 top
R10  71.14,49.98 270 top
R11  65.22,48.15 270 top
R12  65.93,45.81 180 top
R13  69.87,23.21 0 top
R14  62.58,50.36 180 top
R15  81.96,39.41 270 top
R16  15.16,33.95 180 top
R17  68.44,51.15 270 top
R18  75.02,48 0 top
R19  68.24,46.6 270 top
R20  77.36,48.76 270 top
R21  50.56,54.7 270 top
R22  27.6,30.73 90 top
R23  25.82,30.73 90 top
R24  67.68,48.86 180 top
R25  34.08,34.13 180 top
R26  78.25,32.91 270 top
R27  71.24,32.71 270 top
R28  73.27,32.73 270 top
R29  55.41,30.19 0 top
R30  55.39,31.74 0 top
R31  55.41,33.29 0 top
R32  55.44,34.79 0 top
R33  55.41,36.31 0 top
R34  12.21,51.99 90 top
R35  7.66,51.99 90 top
R36  47.62,54.7 90 top
R37  47.52,52.01 180 top
R38  47.62,41.8 180 top
R39  47.57,40.2 180 top
R40  42.13,50.72 180 top
R41  15.13,36.62 180 top
R42  10.71,51.99 90 top
R43  55.01,47.06 90 top
R44  60.22,48.28 90 top
R45  59.53,51.88 180 top
R46  39.95,54.68 90 top
R47  9.21,51.99 90 top
R48  15.21,23.97 180 top
R49  15.18,31.64 180 top
R50  15.21,26.46 180 top
R51  15.16,29.15 180 top
R67  78.88,48.76 270 top
R70  80.41,48.76 270 top
R71  72.64,49.98 270 top
R72  32.91,54.45 90 top
R79  31.21,42.08 90 top
R80  32.78,42.11 90 top
RST  25.75,2.9 180 top
RX  32,37.5 270 top
SD  76.62,62.48 90 top
SW1  9.11,34.1 90 top
SW2  9.11,17.67 90 top
TX  34.5,37.5 270 top
U1  47.06,47.08 270 top
U2  66.39,39.39 225 top
U3  47.59,34.51 0 top
U4  57.62,49.01 90 top
U5  37.63,46.5 90 top
U8  32.07,48.3 270 top
U$1  [MAKERFABS_0.3]  34.64,25.83 0 top
USB-NATIVE  51.5,70.5 180 top
USB-TTL  40.5,70.5 180 top
V  29.5,37.5 270 top
X1  75.81,31.23 90 top

### Tracks (layer width: path | path; a pad name or v marks a point on that pad's centre or on a via)
5V  (via drill 0.3)
  Top 0.254: USB-NATIVE.VBUS2 49.05,69.29 v49.04,69.28 49.04,58.49 C6.2 C54.1 45.15,53.05 45.15,52.24 | 45.15,52.24 U1.4 | 45.15,52.24 45.13,52.27 D6.- 42.89,51.29 R40.1 D3.+ 42.67,48.81 Q3.1
  Top 0.61: U1.8 49.88,43.98 | 49.88,43.98 50.97,43.98 | 50.97,43.98 52.04,42.92 52.04,41.76 CHRG.A DONE.A | v49.83,44.7 49.83,44.03 49.88,43.98 | v43.7,45.23 43.7,46.42 Q3.1 | 49.04,44.31 49.45,44.31 v49.83,44.7 | v49.83,44.7 50.26,44.7 50.61,44.34 | 50.97,43.98 50.61,44.34 | 50.61,44.34 49.85,44.34 | C20.2 53.95,55.7 v53.95,69.28 USB-NATIVE.VBUS1
  Bottom 0.61: v49.04,69.28 v53.95,69.28 | v49.83,44.7 44.24,44.7 v43.7,45.23
  pour Top: 44.37,44.9 43.25,44.9 42.66,45.48 42.66,51.99 43.48,52.8 44.87,52.8 45.64,53.56 45.64,56.2 48.51,59.07 48.84,59.4 48.84,71.29 49.29,71.29 49.29,58.69 46.42,55.82 46.42,53.2 45.46,52.24 45.46,49.57 44.92,49.57 44.39,49.04 44.37,49.01
+3V3  (via drill 0.3, 0.6)
  Top 0.203: U2.46 69.11,34.69 69.11,33.8 | v78.71,47.03 78.88,47.21 R67.2 | 69.11,33.8 69.11,30.4 | 69.11,30.4 69.11,29.66 C17.2 | v73.27,30.98 72.69,30.4 69.11,30.4 | U2.20 62.94,43.68 C10.2 | 70.25,38.65 70.22,38.68 70.48,38.93 70.48,38.55 | 70.48,38.55 70.48,38.42 73.6,35.3 77.49,35.3 77.49,36.42 77.46,36.44 77.46,35.63 77.33,35.5 | v76.37,35.88 74.19,35.88 73.8,35.5 | 69.56,33.34 69.11,33.8 | 70.48,38.55 70.47,38.54 U2.55 U2.56 73.34,36.11 C28.2 C25.2 C36.2 77.08,36.06 77.08,36.01
  Top 0.254: P4.16 P4.15 67.2,21.38 C41.2 69.06,21.73 R7.1 R13.1 69.11,24.58 C23.2 C21.2 68.88,27.2 | 68.88,27.2 C27.2 C17.2 | L3.P$1 68.75,27.07 68.88,27.2 | C26.2 C3.2 C24.2 L1.1 72.64,47.69 R71.2 R10.2 | C26.2 78.72,46.28 C22.1 | R67.2 R20.2 R18.2 75.87,48.09 D5.4 | R67.2 R70.2 | C26.2 v78.71,47.03 78.71,47.82 R67.2 | C8.2 C51.1 | C51.1 C50.1 | U8.10 35.78,45.6 | 35.78,45.6 36.28,45.6 U5.5 | C51.1 35.88,45.5 35.78,45.6 | P1.5 11.5,48.61 12.44,49.55 16.88,49.55 16.83,49.6 16.73,49.6 | 15.97,29.43 15.94,29.46 R49.1
  Top 0.305: v64.76,29.33 C17.2 | 77.33,35.5 73.8,35.5 73.47,35.5 | 70.58,38.62 73.42,35.78 77.31,35.78 77.08,36.01 73.32,36.01
  Top 0.406: 30.02,43.68 29.81,43.88 30.27,43.88 30.8,44.42 | 15.97,29.43 R50.1 R48.1 | 15.97,29.43 15.97,36.44 | 15.97,36.44 15.97,36.64 15.94,36.67 15.94,36.62 | 15.94,36.62 16.7,37.38 16.73,37.28 | 15.94,36.62 16.68,37.28 | R41.1 15.97,36.44 | R51.1 15.97,29.43 | R49.1 R16.1
  Top 0.61: U8.7 31.07,44.59 29.66,43.17 C18.2 | 16.7,52.75 16.7,52.85 C55.2 15.28,52.77 13.71,52.77 | R34.2 13.71,52.75 C57.2 13.71,52.77 | 13.71,52.77 12.29,52.77 | 3V3.T | 3V3.T 16.74,51.2
  Top 0.813: C10.2 C32.2 v57.98,43.68 | C18.2 C52.2 C39.1 29.66,37.46 | 29.66,37.46 29.66,34.18 | 29.66,34.18 v29.66,31.49 R22.2 R23.2 22.47,31.49 16.73,37.23 16.73,37.28 16.73,48.94 16.73,49.6 16.74,51.2 16.74,52.72 | PWR.A 29.63,34.15 29.66,34.18 | V.T 29.62,37.5 29.66,37.46 | 29.66,43.17 v29.66,43.68 30.02,43.68 | 16.74,64.32 16.74,53.03 | R35.2 R47.2 R42.2 R34.2 16.7,52.75 | 16.74,53.03 16.74,51.18 | J1.3 29.69,64.32 v29.71,64.31 | v75.51,64.31 75.52,64.29 SD.4 v75.52,56.01 v75.53,56 | v16.76,64.31 16.74,64.32 | 16.74,64.32 J2.3 | 16.74,52.72 16.74,53.03 | 16.7,52.75 16.73,52.75 | 16.73,52.75 16.74,52.72 | 16.73,52.75 16.7,52.72 16.7,52.75 | C51.1 35.53,42.87 35.53,43.68 | v35.55,43.68 35.53,43.68 | R28.2 v73.27,30.98 | 35.53,43.68 34.66,43.68 v34.66,44.14
  Bottom 0.813: v57.98,43.68 v35.55,43.68 v29.66,43.68 | v64.76,29.33 32.73,29.33 v30.57,31.49 v29.66,31.49 | v16.76,64.31 v29.71,64.31 v75.51,64.31 | v73.27,30.98 73.27,32.78 v76.37,35.88 | v75.53,56 78.71,52.82 v78.71,47.03
  pour Top: 33.77,46.4 33.77,42.49 37.89,42.49 37.89,43.25 36.97,44.16 36.97,46.32 36.97,46.4
  pour Top: 70.65,49.7 70.65,48.63 73.45,45.84 81.04,45.84 81.04,48.43 76.85,48.43 76.52,48.76 76.52,49.57 75.63,49.57 75.25,49.57 75.25,47.52 74.9,47.16 73.68,47.16 73.32,47.52 73.32,49.62 73.32,49.7
  pour Top: 66.59,16.88 66.59,20.87 66.87,21.15 66.87,22.22 68.11,22.22 68.37,22.47 68.37,24.48 67.84,25.01 65.55,25.01 65.55,28.57 65.14,28.97 64.38,28.97 64.38,29.66 68.22,29.66 69.11,30.55 69.11,33.6 69.31,33.6 69.82,33.09 69.82,31.16 70.2,30.78 72.61,30.78 72.89,31.06 72.89,32.38 73.83,32.38 73.83,30.68 73.25,30.09 69.66,30.09 69.38,29.81 69.38,21.25 67.73,21.25 67.25,20.77 67.25,16.88
  pour Top: 16.68,50.41 15.82,49.55 16.63,48.73 16.68,48.79
D+  (via drill 0.3)
  Top 0.254: U8.1 34.08,52.19 40.75,58.86 USB-TTL.A6 40.75,72.19 v40.89,72.33 | USB-TTL.B6 39.75,71.87 v39.29,72.33
  Bottom 0.254: v39.29,72.33 v40.89,72.33
D-
  Top 0.254: U8.2 33.06,51.01 33.06,52.09 40.25,59.27 USB-TTL.A7 40.25,72.66 40.48,72.89 41.42,72.89 41.67,72.64 41.67,72.15 41.25,71.73 USB-TTL.B7
DONE
  Top 0.406: U1.6 46.42,43.38 45.89,42.84 45.89,41.12 R39.2
DTR
  Top 0.305: U8.4 31.07,52.07 30.73,52.42 27.99,52.42 Q5.2 R9.2
EN  (via drill 0.3)  (1 unrouted)
  Top 0.203: U2.4 69.23,40.25 v69.13,40.25
  Top 0.305: R22.1 v27.6,29.3 27.6,6.92 24.05,3.37 24.05,2.89 | v26.33,44.24 25.88,44.24 Q2.3 24.68,43.05 C15.2 24.68,37.35 v27.6,34.43
  Bottom 0.203: v26.33,44.24 29.53,47.44 67.3,47.44 69.13,45.61 v69.13,40.25
  Bottom 0.305: v27.6,34.43 v27.6,29.3
GDR
  Top 0.254: P4.2 73.7,20 74.24,20.54 76.34,20.54 76.67,20.87 76.67,22.56 Q12.1 R6.1
GND  (via drill 0.3)
  Top 0.203: C33.1 59.63,39.39 U2.57 66.39,44.54 | 66.9,39.39 71.14,39.39 | 66.39,34.28 66.39,39.34 | P4.8 70.7,15.77 71.21,15.26 P4.26 | P4.17 66.2,15.78 65.68,15.26 P4.25
  Top 0.61: ANT1.GND 82.54,45.89 81.42,44.77 80.28,44.77 C22.2
  other vias: 88.31,13.45 89.73,14.17 85.59,12.59 15.41,17.47 87.62,76.27 89.45,75.13 90.16,69.64 80.74,4.26 86.63,2.15 89.68,3.65 89.68,11.09 1.9,9.06 4.21,10 5.1,26.2 7.74,26.18 33.75,14.93 48.73,15.97 69.13,7.23 51.05,5.68 41.7,9.29 18.13,30.12 21.3,17.62 21.3,59.58 20.82,48.94 21.25,37.61 39.57,38.02 47.62,38.17 26.15,39.23 45.59,45.74 46.19,45.74 46.85,45.71 47.49,45.71 48.28,45.76 45.97,48.84 47.11,48.89 48.23,48.84 52.93,50.92 54.02,49.98 55.85,45.05 61.41,44.87 63.7,40.3 63.57,38.73 69.36,39.26 72.69,38.42 74.57,38.6 76.09,38.55 77.56,39.13 76.75,39.13 75.71,39.13 75.05,39.13 74.06,39.11 73.14,39.18 72.23,39.23 71.44,39.26 71.95,40.96 72.76,40.96 75.3,41.06 76.01,41.06 76.8,41.04 77.61,41.06 79.8,41.06 80.66,41.06 80.23,36.64 79.72,33.77 84.98,42.84 83.99,42.71 83.28,42.31 83.15,41.34 83.76,39.11 83.53,37.63 83.18,36.95 83.08,35.5 83.61,33.32 80.92,35.02 80.92,36.14 80.92,37.13 80.28,43.1 77.69,42.97 84.83,44.72 84.02,44.8 83.18,44.77 82.24,44.59 81.53,43.98 80.69,42.11 83.69,50.18 82.26,57.04 82.95,52.98 75.56,52.72 78.83,66.18 87.14,66.92 89.48,62.02 74.82,74.72 71.24,68.52 75.86,69.89 50.31,74.85 53.1,74.95 60.67,74.59 56.35,59.07 56.1,67.43 44.75,67.53 45.25,59.66 34.31,66.84 32.83,61.46 30.62,59.4 21.61,54.68 6.77,67.81 2.86,65.96 7.33,74.87 12.29,73.63 16.63,73.63 27.5,72.94 31.28,73.19 39.08,75 42.05,75.43 12.82,56.23 4.21,54.37 11.55,29.94 30.83,49.17 31.41,49.09 28.72,49.57 30.98,48.58 32.02,49.14 32.71,49.12 33.32,49.12 33.09,48.58 32.38,48.61 31.69,48.56 34.94,49.5 37.69,52.72 29.23,54.17 40.25,35.12 41.34,24.25 41.83,15.38 76.5,28.26 72.74,26.87 73.04,25.54 81.48,20.41 79.57,16.35 75.13,8.93 67.68,13.73 68.93,56.2 65.3,58.46 49.65,51.2 56.05,39.21 54.25,38.68 64.86,40.12 64.25,38.04 62.96,39.41 64.84,39.26 64.97,34.54 72.86,28.82 62.88,32.61 64.99,30.29 60.72,30.27 54.7,26.74 56.46,38.45 57.45,35.58 55.14,38.8 64.43,24.22 62.81,24.27 59.22,25.37 58.26,23.64 64.99,37.3 65.04,38.35 63.97,39.39 50.03,37.91 44.49,37.91 35.83,38.6 37.53,36.29 41.01,33.52 48.18,36.19 59.12,35.6 79.77,35.35 78.55,35.17 78.22,27.58 78.58,26 78.68,24.86 78.76,23.89 79.7,22.19 81.6,22.12 83.1,22.09 84.88,22.17 86.66,22.06 87.9,22.06 89.48,22.04 88.69,20.49 82.8,20.44 84.22,20.85 79.47,20.87 77.13,18.41 80.28,18.48 80.71,13.45 81.91,10.91
  pour Top (isolate 0.254, rank 6): -3.5,85.5 -3.5,-4.5 100.5,-4.5 100.5,85.5
  pour Bottom (isolate 0.254, rank 6): -4.5,-4.5 100.5,-4.5 100.5,85.5 -4.5,85.5
  pour Top (isolate 0.152): 70.25,41.19 82.01,41.19 82.01,38.88 70.25,38.88
IO0  (via drill 0.3)
  Top 0.203: U2.5 69.89,41.48 v69.89,42.28
  Top 0.254: v25.82,29.3 25.82,24.68 15.99,14.85 15.99,4.27 FLASH.2 17.34,3.37 17.34,3.27
  Top 0.305: R23.1 v25.82,29.3 | Q5.3 24.66,52.98 23.54,51.86 23.54,47.97 | 23.54,47.97 23.54,37.08 v25.82,34.79 | 23.54,47.97 v23.46,47.9
  Bottom 0.203: v69.89,42.28 69.61,42.56 69.61,45.81 67.53,47.9 23.54,47.9
  Bottom 0.305: v25.82,34.79 v25.82,29.3 | 23.54,47.9 v23.46,47.9
IO2/CMD  (via drill 0.3)
  Top 0.203: v71.98,45.15 69.31,42.49 69.31,42.03 U2.7
  Top 0.305: SD.3 74.42,53.6 v74.41,53.59 | D5.3 74.26,49.22 R18.1 74.26,48.62 v74.4,48.76
  Bottom 0.305: v74.41,53.59 74.41,48.75 | v71.98,45.15 74.41,47.59 74.41,48.75 | 74.41,48.75 v74.4,48.76
IO4/BAT
  Top 0.203: U2.9 69.82,43.66 C31.2
  Top 0.254: C31.2 R19.2 66.72,45.84 R12.1
IO5  (via drill 0.3)
  Top 0.203: U2.10 68.78,43.19 68.78,44.37 68.42,44.72 v67.12,44.72 | v19.57,42.84 17.9,41.16 v17.9,38.65 | R41.2 14.34,36.59 v12.87,36.59 9.12,36.59 SW1.2
  Bottom 0.203: v67.12,44.72 66.92,44.92 62.37,44.92 60.29,42.84 60.24,42.89 23.69,42.89 23.26,43.32 20.06,43.32 v19.57,42.84 19.57,42.82 | v17.9,38.65 15.84,36.59 v12.87,36.59
IO9/BUSY  (via drill 0.3)
  Top 0.203: P4.9 | U2.14 67.33,44.01 v67.94,44.01
  Top 0.254: P4.9 70.2,18.38 71.64,19.83 v71.9,19.83
  Bottom 0.203: v67.94,44.01 67.94,22.6 68.67,21.86 69.87,21.86 v71.9,19.83
IO10/RES  (via drill 0.3)
  Top 0.203: U2.15 65.3,44.16 v65.3,44.37 | v70.83,19.91 70.91,19.83
  Top 0.254: R13.2 71.59,22.24 71.59,20.52 70.91,19.83 69.7,18.62 P4.10
  Bottom 0.203: v65.3,44.37 67.48,42.18 67.48,22.39 68.47,21.4 69.33,21.4 v70.83,19.91
IO11/DC  (via drill 0.3)
  Top 0.203: U2.16 64.98,43.91 64.64,43.91 64.38,44.16 v64.38,44.21
  Top 0.254: P4.11 69.2,19.01 v70.05,19.86
  Bottom 0.203: v70.05,19.86 69.03,20.87 68.34,20.87 67.02,22.19 67.02,41.85 65.07,43.81 64.79,43.81 v64.38,44.21
IO12  (via drill 0.3)
  Top 0.203: v22.55,42.38 19.88,39.72 v19.88,36.47 | R49.2 12.87,31.64 arc90 v12.84,31.61 9.12,31.61 SW1.1 | U2.17 64.92,43.4 64.13,43.4 v63.34,44.19
  Bottom 0.203: v22.55,42.38 60.67,42.38 62.48,44.19 v63.34,44.19 | v19.88,36.47 15.03,31.61 v12.84,31.61
IO13/SDI  (via drill 0.3)
  Top 0.203: U2.18 65.42,42.33 v65.7,42.33
  Top 0.254: P4.14 67.7,20.35 v67.83,20.49
  Bottom 0.203: v65.7,42.33 66.56,41.47 66.56,21.76 v67.83,20.49
IO14/SCLK  (via drill 0.3)
  Top 0.203: U2.19 65.17,42.02 v65.17,41.85
  Top 0.254: P4.13 68.2,19.81 v68.67,20.29
  Bottom 0.203: v65.17,41.85 66.11,40.91 66.11,21.1 67.3,19.91 68.29,19.91 v68.67,20.29
IO15/CS  (via drill 0.3)
  Top 0.203: U2.21 64.64,41.42 v64.66,41.42
  Top 0.254: P4.12 68.7,19.4 v68.95,19.65 70.63,21.33 R7.2
  Bottom 0.203: v64.66,41.42 65.65,40.43 65.65,20.82 67.02,19.45 68.75,19.45 v68.95,19.65
IO16/TP_INT  (via drill 0.3)
  Top 0.203: v62.5,42.44 63.06,42.44 U2.22 | 63.92,41.57 63.87,41.62 U2.22 | U2.22
  Top 0.254: P1.3 10.5,49.62 10.86,49.98 v10.86,50.54 10.86,51.07 R42.1
  Bottom 0.203: v10.86,50.54 11.07,50.54 19.02,41.39 61.46,41.39 v62.5,42.44
IO17  (via drill 0.3)
  Top 0.203: U2.23 64.02,40.91 v64.2,40.91 | v21.33,41.9 21.2,41.9 18.97,39.67 v18.97,36.57 | R16.2 12.87,33.95 arc90 v12.84,33.93 9.29,33.93 SW1.T
  Bottom 0.203: v64.2,40.91 63.52,41.6 63.52,42.44 62.86,43.1 62.2,43.1 61,41.9 v21.33,41.9 | v18.97,36.57 16.32,33.93 v12.84,33.93
IO18  (via drill 0.3)
  Top 0.203: v30.73,28.69 31.77,28.69 42,38.93 53.13,38.93 55.03,40.84 v60.93,40.84 | SW2.2 10.16,20.17 10.63,20.64 10.63,26.26 v13.07,28.69 13.45,29.07 14.32,29.07 R51.2 | 63.29,41.06 62.81,41.55 v62.81,41.7 62.81,41.55 U2.24
  Bottom 0.203: v60.93,40.84 61.94,40.84 v62.81,41.7 | v30.73,28.69 v13.07,28.69
IO19  (via drill 0.3)
  Top 0.203: U2.25 61.79,42 55.92,42 51.66,46.27 51.66,52.27 v50.74,53.18 50.56,53.36 R21.2 | 25.69,56.35 v25.67,56.33
  Top 0.305: J1.1 25.69,56.35
  Bottom 0.203: v25.67,56.33 47.59,56.33 v50.74,53.18
IO20  (via drill 0.3)
  Top 0.203: U2.26 61.68,41.55 55.69,41.55 51.1,46.14 51.1,51.94 v49.81,53.22 R2.2 | v27.69,55.73 v27.7,55.72
  Top 0.305: J1.2 v27.69,55.73
  Bottom 0.203: v27.7,55.72 47.31,55.72 v49.81,53.22
IO21/TP_RST  (via drill 0.3)
  Top 0.203: U2.27 62.11,40.56 61.44,40.56 v61.03,40.15
  Top 0.254: P1.4 11,49.25 v11.21,49.46 12.21,50.46 R34.1
  Bottom 0.203: v11.21,49.46 18.53,40.89 59.63,40.89 60.37,40.15 v61.03,40.15
IO38/SCL  (via drill 0.3)
  Top 0.203: J2.2 | v63.64,33.65 66.52,33.65 67.25,34.38 67.25,34.85 U2.43 | 9.5,49.39 9.24,49.65 v9.24,49.78
  Top 0.254: P1.1 9.5,49.39 R35.1
  Top 0.305: v14.75,61.36 J2.2
  Bottom 0.203: v63.64,33.65 63.64,35.93 58.44,39.87 17.64,39.87 9.37,49.42 9.37,49.65 | 9.37,49.65 9.37,55.97 v14.75,61.36 | 9.37,49.65 v9.24,49.78
IO39/SDA  (via drill 0.3)
  Top 0.203: 12.84,67.76 J2.1 | v64.23,33.06 66.72,33.06 67.86,34.21 67.86,34.8 U2.44 | v9.97,50.08 9.97,50.41 10,50.44
  Top 0.254: P1.2 10,50.44 | 10,50.44 | 10,50.44 R47.1
  Top 0.305: v12.84,58.5 12.84,67.76
  Bottom 0.203: v64.23,33.06 64.23,36.06 58.64,40.38 17.98,40.38 9.97,49.65 v9.97,50.08 9.97,55.63 v12.84,58.5
IO40/CTRL  (via drill 0.3)
  Top 0.203: U2.45 68.52,34.71 v68.52,32.73
  Top 0.254: R24.2 67,48.78 v67,46.83
  Bottom 0.203: v68.52,32.73 68.52,45.31 v67,46.83
IO41/D0  (via drill 0.3)
  Top 0.203: U2.47 69.56,34.8 69.56,34.1 69.89,33.77 v70.17,33.77 | 78.81,50.64 78.81,50.65 78.82,50.66
  Top 0.305: SD.7 78.82,50.87 | 78.82,50.87 78.82,50.66 78.82,49.58 R67.1 | D5.6 v77.31,50.91 78.78,50.91 78.82,50.87 | 78.81,51.2 78.53,50.92 78.81,50.64
  Bottom 0.203: v70.17,33.77 70.33,33.77 70.73,34.18 70.73,40.63 77.31,47.21 v77.31,50.91
IO42/SCLK  (via drill 0.3)
  Top 0.203: U2.48 70.15,34.78 v70.15,34.48 | SD.5 v76.62,53.36
  Top 0.305: D5.5 v76.62,50.16 76.72,50.16 R20.1
  Bottom 0.203: v70.15,34.48 70.15,40.86 76.62,47.34 v76.62,50.16 v76.62,53.36
IO45
  Top 0.203: U2.51 73.13,33.49 R28.1
IO47  (via drill 0.3)
  Top 0.203: U2.37 57.62,29.78 57.62,29.33 56.86,28.57 35.58,28.57 v31.82,24.81 | 14.39,23.92 R48.2 13.05,23.97 13,23.92 v13,23.89 12.97,23.92 12.97,17.62 10.53,15.18 9.12,15.18 SW2.1
  Bottom 0.203: 30.93,23.92 12.97,23.92 v13,23.89 | v31.82,24.81 30.93,23.92 | 30.95,23.92 30.93,23.92
IO48  (via drill 0.3)
  Top 0.203: U2.36 57.19,29.91 57.19,29.53 56.74,29.07 35.3,29.07 34,27.78 v30.5,27.78 | SW2.T 10.48,17.67 11.78,18.97 11.78,25.11 v13,26.33 14.32,26.33 R50.2
  Bottom 0.203: v30.5,27.78 14.45,27.78 v13,26.33
ISET
  Top 0.406: U1.2 47.69,50.92 48.28,51.5 R37.1
N$1
  Top 0.254: P4.5 72.2,18.86 72.64,19.3 C38.1
N$2
  Top 0.762: R1.1 81.96,42.28 arc-90 83.41,43.73 ANT1.FEED
N$3
  Top 0.406: C16.1 63.52,48.63 63.52,47.57 Q6.1 65.2,47.37 R11.2
N$4
  Top 0.254: P4.19 65.2,20.99 C43.1
N$5
  Top 0.254: P4.20 64.7,19.99 C44.1
N$6
  Top 0.254: USB-NATIVE.A5 52.75,56.05 R3.2
N$7
  Top 0.254: 33.29,34.15 R25.2
  Top 0.61: PWR.C 33.29,34.15
N$8
  Top 0.305: R9.1 26.51,45.96 Q2.1
N$9
  Top 0.254: P4.22 63.7,18.68 61.31,21.07 61.31,21.96 C45.1
N$10
  Top 0.406: R12.2 63.3,45.81 Q6.3
N$11
  Top 0.406: D2.C 57.17,26.08 | 57.17,26.08 57.17,27.5 C48.1 | D4.A 57.12,26.03 57.17,26.08
N$12
  Top 0.305: R8.1 24.61,50.93 Q5.1
N$13
  Top 0.406: U8.8 32.07,43.7 R79.2
N$14
  Top 0.254: USB-NATIVE.B5 49.75,57.6 R36.2
N$15
  Top 0.305: Q7.3 65.22,50.92 65.22,50.59 | 65.22,50.59 65.22,50.26 | 65.22,50.26 65.22,50.03 | 65.22,50.03 R11.1 | R14.1 64.89,50.36 | 64.99,50.36 65.12,50.36 65.22,50.26 | 65.22,50.03 64.89,50.36 | 64.89,50.36 64.99,50.36 | 64.99,50.36 65.22,50.59
N$16
  Top 0.305: SD.1 72.22,51.83 R10.1
N$17
  Top 0.254: USB-TTL.A5 41.75,57.24 R46.2
N$18
  Top 0.254: USB-TTL.B5 38.75,61.05 R72.2
N$19
  Top 0.406: Q7.1 68.36,50.3 R17.2 R24.1
N$20
  Top 0.305: SD.8 79.92,50.01 R70.1
N$22
  Top 0.254: P4.18 65.7,21.43 C40.1
N$23
  Top 0.406: R39.1 DONE.C
N$24
  Top 0.406: U1.7 47.69,43.27 46.85,42.44 R38.2
N$25
  Top 0.254: 81.93,38.45 81.93,38.6 81.98,38.65 R15.2
  Top 0.762: ANT.2 arc90 81.93,32.91 81.93,38.45
N$26
  Top 0.254: 72.94,50.92 72.64,50.92 R71.1
  Top 0.305: D5.1 73.35,50.91 | 73.35,50.91 72.8,50.91 R71.1 | SD.2 73.32,50.93 73.35,50.91 | 72.94,50.92 73.32,51.3 73.68,50.94 73.68,50.92
N$27
  Top 0.406: R38.1 49.89,41.8 CHRG.C
N$28
  Top 0.61: C5.1 57.88,51.88 | 57.88,51.88 R45.2 | U4.5 57.62,51.63 57.88,51.88
N$29
  Top 0.203: 55.34,47.81 R43.2
  Top 0.61: U4.1 55.34,47.81
N$30
  Top 0.254: R15.1 81.96,40.81 R1.2
  Top 0.762: R1.2 arc-90 81.25,40.1 C12.2 | C12.2 77.39,40.1 | 77.39,40.1 L2.1 | L2.1 arc-90 77.23,40.11 77.23,40.12 | 77.21,40.1 L2.1 | 77.39,40.1 arc90 77.42,40.06 L4.2 | C12.2 L2.1
N$31
  Top 0.152: U2.1 | 70.66,39.95 71.09,39.95 71.09,40.28 70.98,40.28 70.66,39.95
  Top 0.203: U2.1 70.78,40.1 71.44,40.1 | L2.2 75.28,40.38 71.06,40.38 U2.1 | 74.31,39.97 74.16,39.82 70.5,39.82 U2.1 | U2.1 70.66,39.95 71.19,39.95
  Top 0.254: 74.31,39.97 74.19,39.97 C13.2 | L2.2
  Top 0.762: L2.2 C13.2 71.44,40.1
N$32
  Top 0.203: U2.35 56.91,30.19 R29.2
N$33
  Top 0.203: U2.2 73.31,43.2 C19.2 L1.2 | U2.3 U2.2 | U2.2 | 69.94,40.38 70.2,40.12 70.45,40.38 | 70.48,40.4 70.45,40.38 | 70.45,40.38 70.2,40.63 73.7,44.14 73.7,45.1 74.36,45.1 | 70.33,40.48 73.19,43.35 73.6,43.35 73.6,43.53 73.14,43.53 73.27,43.66 73.91,43.66 73.86,43.7 73.86,44.31 73.73,44.19 73.73,44.14 73.73,43.78 73.68,43.83 73.5,43.83
  Top 0.254: 74.26,44.75 74.06,44.75 L1.2 73.73,44.47 73.73,44.19 | 73.7,44.14 73.73,44.14
  Top 0.406: 74.26,44.75 74.26,43.38
N$34
  Top 0.203: 80.35,38.37 L4.1
  Top 0.762: C14.2 80.35,38.37
N$35
  Top 0.203: U2.34 57.89,31.74 R30.2
N$36
  Top 0.406: U8.9 33.07,43.16 R80.2
N$37
  Top 0.203: U2.54 73.43,34.89 77.03,34.89 R26.1
N$38
  Top 0.203: U2.33 58.88,33.29 R31.2
N$40
  Top 0.203: U2.31 59.24,34.79 R32.2
N$41
  Top 0.203: U2.30 60.2,36.31 R33.2
N$63
  Top 0.203: U2.49 71.24,34.25 R27.1
N$65
  Top 0.203: U2.53 73.32,34.43 74.41,34.43 C9.2 74.97,32.37 X1.3
N$66
  Top 0.203: R26.2 78.25,30.52 C4.1 76.97,30.5 X1.1
N$71  (via drill 0.3)
  Top 0.254: Q12.3 v77.69,21.66
  Top 0.61: C48.2 60.32,27.65 | 60.32,27.65 61.41,27.65 | 61.41,27.65 62.1,27.65 L3.P$2 | D1.A 60.39,27.73 60.32,27.65 | v61.38,27.42 61.38,27.63 61.41,27.65
  Bottom 0.254: v77.69,21.66 73.55,17.52 64.36,17.52 61.38,20.49 v61.38,27.42
N$76
  Top 0.406: U5.4 C11.2
PREVGH
  Top 0.254: P4.21 64.2,18.94 61.87,21.28 61.87,22.93 C49.1 D1.C
PREVGL
  Top 0.254: P4.23 63.2,18.37 60.76,20.81 60.62,20.95 | 60.62,20.95 C47.1 | D2.A 59.77,21.8 60.62,20.95
RESE
  Top 0.254: P4.3 73.2,20.7 R5.1 75.62,21.71 Q12.2
RTS
  Top 0.305: R8.2 24.61,45.95 Q2.2 | U8.6 29.39,44.92 25.54,44.92 24.66,45.81 24.66,45.97
  Top 0.813: 24.61,45.95 24.66,45.95 24.66,45.97
RXD/IO44  (via drill 0.3)
  Top 0.203: U2.50 72.25,33.8 v72.25,31.31 | v63.19,30.9 v68.55,30.9
  Top 0.254: R79.1 v31.21,38.32 31.21,38.29 RX.T
  Bottom 0.203: v31.21,38.32 38.62,30.9 v63.19,30.9 | v68.55,30.9 71.85,30.9 v72.25,31.31
SPICLK
  Top 0.406: U3.6 52.75,33.88 53.33,33.29 R31.1
SPICS0  (via drill 0.3)
  Top 0.203: U2.32 59.07,34.05 v57.4,34.05
  Top 0.406: U3.1 v44.59,36.42
  Bottom 0.406: v57.4,34.05 46.96,34.05 v44.59,36.42
SPID
  Top 0.406: U3.5 51.64,32.49 53.94,30.19 R29.1
SPIHD
  Top 0.406: U3.7 52.59,35.15 53.76,36.31 R33.1
SPIQ  (via drill 0.3)
  Top 0.406: v44.57,35.15 U3.2 | R30.1 54.04,31.74 v53.41,32.38
  Bottom 0.406: v53.41,32.38 52.55,33.24 46.47,33.24 v44.57,35.15
SPIWP  (via drill 0.3)
  Top 0.203: 54.65,34.77 R32.1
  Top 0.406: 54.65,34.77 v53.74,34.77 | U3.3 46.83,33.88 v47.72,34.77
  Bottom 0.406: v53.74,34.77 v47.72,34.77
TXD/IO43  (via drill 0.3)
  Top 0.203: TX.T v33.55,38.45 | v63.8,31.61 v68.52,31.61 | R27.2 70.91,31.61 v70.38,31.61
  Top 0.254: R80.1 32.78,39.22 TX.T
  Bottom 0.203: v33.55,38.45 40.38,31.61 v63.8,31.61 | v68.52,31.61 v70.38,31.61
USB_D+
  Top 0.203: 51.76,69.97 51.43,69.64 51.73,69.33
  Top 0.254: USB-NATIVE.A6 51.75,69.64 | 51.75,69.64 51.75,58.12 R2.1 | USB-NATIVE.B6 50.75,69.99 51.1,69.64 51.43,69.64 51.75,69.64
USB_D-
  Top 0.254: R21.1 52.25,57.15 USB-NATIVE.B7 52.24,71.75 52.06,71.92 51.5,71.92 51.25,71.67 USB-NATIVE.A7
VBAT+  (via drill 0.3)
  Top 0.203: 41.73,45.36 Q3.3
  Top 0.61: U1.5 C53.1 C1.2 41.77,45.3 Q3.3 | 41.73,45.36 41.73,46.09 v41.72,46.09 | v61.82,46.75 Q6.2 61.8,48.8 C16.2 R14.2 C2.2 61.31,51.88 | R45.1 61.31,51.88 | BAT.+ 62.31,52.88 61.31,51.88
  Bottom 0.61: v61.82,46.75 42.38,46.75 v41.72,46.09
VBAT-
  Top 0.203: U4.6 56.63,50.26
  Top 0.406: 58.01,49.01 58.08,49.01 58.62,48.48 59.17,49.04
  Top 0.61: BAT.- 60.31,56.78 56,52.47 56,51.86 | 56,51.86 56,50.26 | 56,50.26 56,49.95 56.94,49.01 58.01,49.01 58.62,49.01 | 58.62,49.01 60.19,49.01 R44.2 | U4.3 58.58,48.97 58.62,49.01 | C5.2 55.97,51.88 56,51.86 | 56.63,50.26 56,50.26
VBUS  (via drill 0.3)
  Top 0.254: v42.95,69.37 v42.94,69.36
  Top 0.61: USB-TTL.VBUS1 v42.95,69.37 42.95,69.33 42.95,57.4 41.47,55.92 C30.2 C29.2 D6.+ | USB-TTL.VBUS2 v38.05,69.36 38.05,62.18 31.31,55.44 C34.2
  Bottom 0.61: v42.94,69.36 v38.05,69.36
VCOM
  Top 0.254: P4.24 62.7,17.68 60.95,19.42 C46.1
VDD_SPI
  Top 0.203: U2.29 60.83,37.51 C33.2
  Top 0.61: U3.8 52.73,37.51 C35.2 C33.2
VSYS
  Top 0.254: D3.- C42.2 38.91,47.48 U5.3 40.28,47.45 | Q3.2 40.28,47.45 | U5.1 39.91,45.55 40.3,45.94 40.3,47.42 40.28,47.45
  pour Top: 38.4,49.5 41.04,49.5 41.22,49.32 41.22,47.01 41.22,46.58 40.94,46.3 40.94,45.2 38.35,45.2 38.35,45.84 39.82,45.84 40.02,46.04 40.02,47.01 39.84,47.19 38.37,47.19 38.37,49.47

### Text on the board
tPlace: IO39/SDA | IO38/SCL | 3V3 | GND | IO19 | IO20 | 3V3 | GND | - | + | ESP32-S3 4.2" EINK V1.3 | www.makerfabs.com
bPlace: - | +